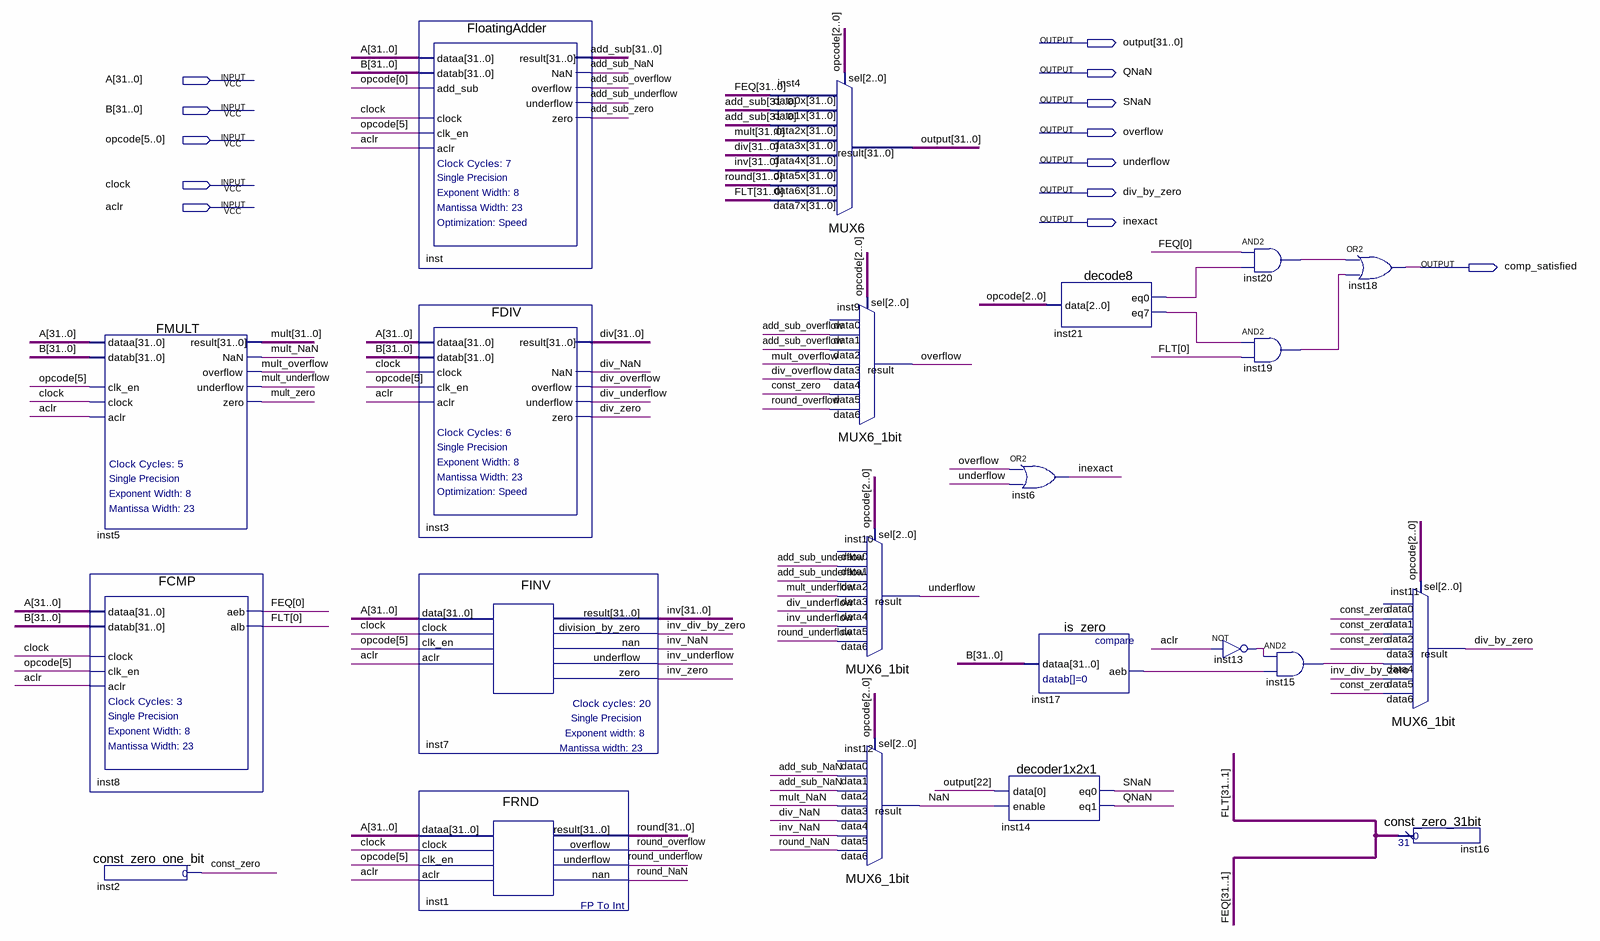
[diagram p0: schematic sheet]
// Quartus schematic FALU.bdf as structural Verilog: 22 symbols, 13 pins
module FALU (
  input  [31:0] A,
  input  [31:0] B,
  input  [5:0] opcode,
  input  clock,
  input  aclr,
  output [31:0] \output ,
  output QNaN,
  output SNaN,
  output overflow,
  output underflow,
  output div_by_zero,
  output inexact,
  output comp_satisfied
);

  wire add_sub_NaN, add_sub_overflow, add_sub_underflow, add_sub_zero, const_zero, div_NaN, div_overflow,
       div_underflow, div_zero, inst13_out, inst15_out, inst17_aeb, inst19_out, inst20_out, inst21_eq0,
       inst21_eq7, inv_div_by_zero, inv_NaN, inv_underflow, inv_zero, mult_NaN, mult_overflow,
       mult_underflow, mult_zero, NaN, round_NaN, round_overflow, round_underflow;
  wire [31:0] add_sub, div, FEQ, FLT, inv, mult, round;

  FMULT inst5 (
    .dataa(A), .datab(B), .clk_en(opcode[5]), .clock(clock), .aclr(aclr), .result(mult), .NaN(mult_NaN),
    .overflow(mult_overflow), .underflow(mult_underflow), .zero(mult_zero));
  FCMP inst8 (.dataa(A), .datab(B), .clock(clock), .clk_en(opcode[5]), .aclr(aclr), .aeb(FEQ[0]), .alb(FLT[0]));
  const_zero_one_bit inst2 (.result(const_zero));
  FloatingAdder inst (
    .dataa(A), .datab(B), .add_sub(opcode[0]), .clock(clock), .clk_en(opcode[5]), .aclr(aclr),
    .result(add_sub), .NaN(add_sub_NaN), .overflow(add_sub_overflow), .underflow(add_sub_underflow),
    .zero(add_sub_zero));
  FDIV inst3 (
    .dataa(A), .datab(B), .clock(clock), .clk_en(opcode[5]), .aclr(aclr), .result(div), .NaN(div_NaN),
    .overflow(div_overflow), .underflow(div_underflow), .zero(div_zero));
  FINV inst7 (
    .data(A), .clock(clock), .clk_en(opcode[5]), .aclr(aclr), .result(inv),
    .division_by_zero(inv_div_by_zero), .nan(inv_NaN), .underflow(inv_underflow), .zero(inv_zero));
  FRND inst1 (
    .dataa(A), .clock(clock), .clk_en(opcode[5]), .aclr(aclr), .result(round), .overflow(round_overflow),
    .underflow(round_underflow), .nan(round_NaN));
  MUX6 inst4 (
    .data7x(FLT), .data6x(round), .data5x(inv), .data4x(div), .data3x(mult), .data2x(add_sub),
    .data1x(add_sub), .data0x(FEQ), .sel(opcode[2:0]), .result(\output ));
  MUX6_1bit inst9 (
    .data6(round_overflow), .data5(const_zero), .data4(div_overflow), .data3(mult_overflow),
    .data2(add_sub_overflow), .data1(add_sub_overflow), .sel(opcode[2:0]), .result(overflow));  // open: data0
  MUX6_1bit inst10 (
    .data6(round_underflow), .data5(inv_underflow), .data4(div_underflow), .data3(mult_underflow),
    .data2(add_sub_underflow), .data1(add_sub_underflow), .sel(opcode[2:0]), .result(underflow));  // open: data0
  MUX6_1bit inst12 (
    .data6(round_NaN), .data5(inv_NaN), .data4(div_NaN), .data3(mult_NaN), .data2(add_sub_NaN),
    .data1(add_sub_NaN), .sel(opcode[2:0]), .result(NaN));  // open: data0
  decoder1x2x1 inst14 (.data(\output [22]), .enable(NaN), .eq0(SNaN), .eq1(QNaN));
  decode8 inst21 (.data(opcode[2:0]), .eq0(inst21_eq0), .eq7(inst21_eq7));
  or inst6 (inexact, overflow, underflow);
  is_zero inst17 (.dataa(B), .aeb(inst17_aeb));
  and inst20 (inst20_out, FEQ[0], inst21_eq0);
  and inst19 (inst19_out, inst21_eq7, FLT[0]);
  not inst13 (inst13_out, aclr);
  and inst15 (inst15_out, inst13_out, inst17_aeb);
  or inst18 (comp_satisfied, inst20_out, inst19_out);
  MUX6_1bit inst11 (
    .data6(const_zero), .data5(inv_div_by_zero), .data4(inst15_out), .data3(const_zero), .data2(const_zero),
    .data1(const_zero), .sel(opcode[2:0]), .result(div_by_zero));  // open: data0
  const_zero_31bit inst16 (.result(FLT[31:1]));
endmodule
